# Altium schematic sheet Схема.SchDoc
size 594 x 840 mm
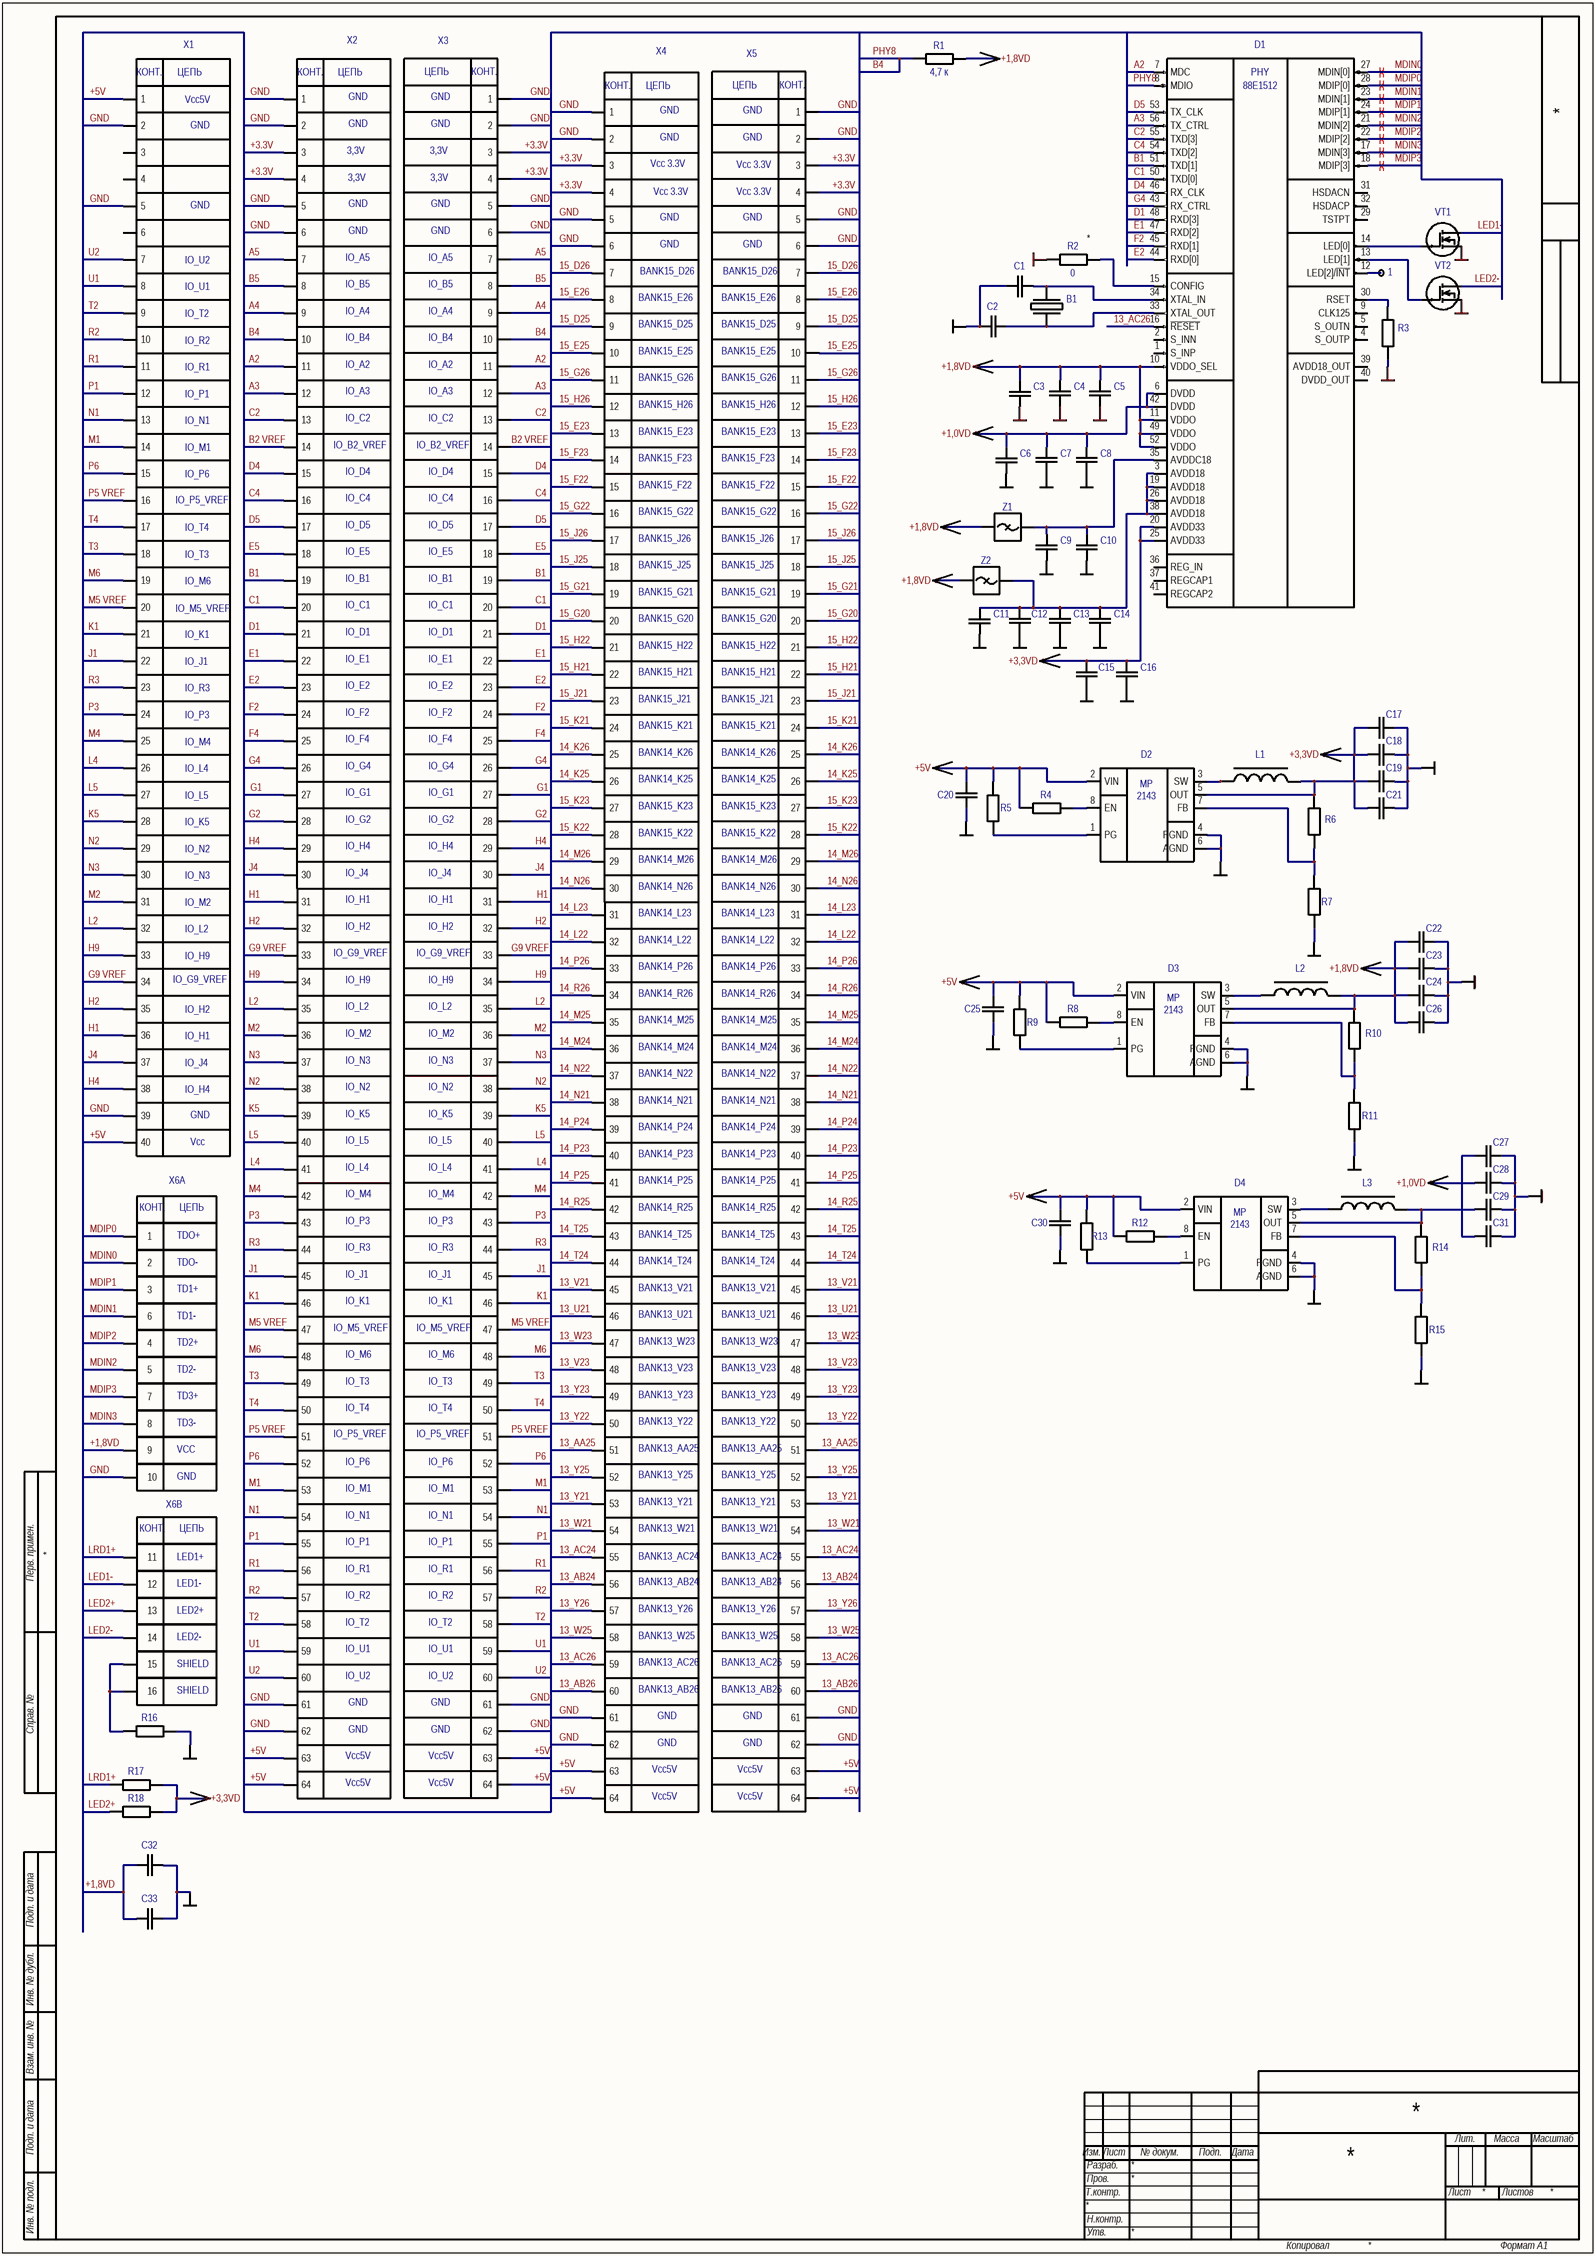
[diagram p0: Схема.SchDoc]

## Parts
(Parts that share a designator on the sheet are numbered #1, #2 ... from top to bottom, then left to right.)
1  TP_1  [TP0.3]  (value not drawn)  (no BOM)
*?#1  VCC  (value not drawn)  (graphical)
*?#2  VCC  (value not drawn)  (graphical)
*?#3  VCC  (value not drawn)  (graphical)
*?#4  VCC  (value not drawn)  (graphical)
*?#5  VCC  (value not drawn)  (graphical)
*?#6  VCC  (value not drawn)  (graphical)
*?#7  VCC  (value not drawn)  (graphical)
*?#8  VCC  (value not drawn)  (graphical)
*?#9  VCC  (value not drawn)  (graphical)
*?#10  VCC  (value not drawn)  (graphical)
*?#11  VCC  (value not drawn)  (graphical)
*?#12  VCC  (value not drawn)  (graphical)
*?#13  VCC  (value not drawn)  (graphical)
B1  РК540-5ДП-25000К-П18  [DFN580P700X120-4N]  (value not drawn)
C1  18  [CAPC1608L]  (value not drawn)
C2  18  [CAPC1608L]  (value not drawn)
C3  4,7 мк  [CAPC1608L]  (value not drawn)
C4  1 мк  [CAPC1608L]  (value not drawn)
C5  0,1 мк  [CAPC1005L]  (value not drawn)
C6  4,7 мк  [CAPC1608L]  (value not drawn)
C7  1 мк  [CAPC1608L]  (value not drawn)
C8  0,1 мк  [CAPC1005L]  (value not drawn)
C9  10 мк  [CAPC1608L]  (value not drawn)
C10  4,7 мк  [CAPC1608L]  (value not drawn)
C11  4,7 мк  [CAPC1608L]  (value not drawn)
C12  1 мк  [CAPC1608L]  (value not drawn)
C13  0,1 мк  [CAPC1005L]  (value not drawn)
C14  0,1 мк  [CAPC1005L]  (value not drawn)
C15  1 мк  [CAPC1608L]  (value not drawn)
C16  0,1 мк  [CAPC1005L]  (value not drawn)
C17  22 мк  [CAPC2012L]  (value not drawn)
C18  22 мк  [CAPC2012L]  (value not drawn)
C19  0,1 мк  [CAPC1608L]  (value not drawn)
C20  22 мк  [CAPC2012L]  (value not drawn)
C21  0,1 мк  [CAPC1608L]  (value not drawn)
C22  22 мк  [CAPC2012L]  (value not drawn)
C23  22 мк  [CAPC2012L]  (value not drawn)
C24  0,1 мк  [CAPC1608L]  (value not drawn)
C25  22 мк  [CAPC2012L]  (value not drawn)
C26  0,1 мк  [CAPC1608L]  (value not drawn)
C27  22 мк  [CAPC2012L]  (value not drawn)
C28  22 мк  [CAPC2012L]  (value not drawn)
C29  0,1 мк  [CAPC1608L]  (value not drawn)
C30  22 мк  [CAPC2012L]  (value not drawn)
C31  0,1 мк  [CAPC1608L]  (value not drawn)
C32  0,1 мк  [CAPC1608L]  (value not drawn)
C33  1000  [CAPC1608L]  (value not drawn)
D1  88E1512-A0-NNP2I000*  [QFN50P800X800X100_HS-57N]  (value not drawn)
D2  MP2143  [MP2143]  (value not drawn)
D3  MP2143  [MP2143]  (value not drawn)
D4  MP2143  [MP2143]  (value not drawn)
GND#1  GND GOST  (value not drawn)  (graphical)
GND#2  GND GOST  (value not drawn)  (graphical)
GND?#1  GND GOST  (value not drawn)  (graphical)
GND?#2  GND GOST  (value not drawn)  (graphical)
GND?#3  GND GOST  (value not drawn)  (graphical)
GND?#4  GND GOST  (value not drawn)  (graphical)
GND?#5  GND GOST  (value not drawn)  (graphical)
GND?#6  GND GOST  (value not drawn)  (graphical)
GND?#7  GND GOST  (value not drawn)  (graphical)
GND?#8  GND GOST  (value not drawn)  (graphical)
GND?#9  GND GOST  (value not drawn)  (graphical)
GND?#10  GND GOST  (value not drawn)  (graphical)
GND?#11  GND GOST  (value not drawn)  (graphical)
GND?#12  GND GOST  (value not drawn)  (graphical)
GND?#13  GND GOST  (value not drawn)  (graphical)
GND?#14  GND GOST  (value not drawn)  (graphical)
GND?#15  GND GOST  (value not drawn)  (graphical)
GND?#16  GND GOST  (value not drawn)  (graphical)
GND?#17  GND GOST  (value not drawn)  (graphical)
GND?#18  GND GOST  (value not drawn)  (graphical)
GND?#19  GND GOST  (value not drawn)  (graphical)
GND?#20  GND GOST  (value not drawn)  (graphical)
GND?#21  GND GOST  (value not drawn)  (graphical)
GND?#22  GND GOST  (value not drawn)  (graphical)
GND?#23  GND GOST  (value not drawn)  (graphical)
GND?#24  GND GOST  (value not drawn)  (graphical)
GND?#25  GND GOST  (value not drawn)  (graphical)
GND?#26  GND GOST  (value not drawn)  (graphical)
GND?#27  GND GOST  (value not drawn)  (graphical)
GND?#28  GND GOST  (value not drawn)  (graphical)
GND?#29  GND GOST  (value not drawn)  (graphical)
GND?#30  GND GOST  (value not drawn)  (graphical)
GND?#31  GND GOST  (value not drawn)  (graphical)
L1  1 мк  [INDC6466X32N]  (value not drawn)
L2  1 мк  [INDC6466X32N]  (value not drawn)
L3  1 мк  [INDC6466X32N]  (value not drawn)
R1  4,7 к  [RESC1005L]
R2  0  [RESC1005L]
R3  4,99 к  [RESC1608L]  (value not drawn)
R4  100 к  [RESC1608L]  (value not drawn)
R5  100 к  [RESC1608L]  (value not drawn)
R6  200 к  [RESC2012X90]  (value not drawn)
R7  44,2 к  [RESC1005L]  (value not drawn)
R8  100 к  [RESC1608L]  (value not drawn)
R9  100 к  [RESC1608L]  (value not drawn)
R10  200 к  [RESC2012X90]  (value not drawn)
R11  100 к  [RESC1608L]  (value not drawn)
R12  100 к  [RESC1608L]  (value not drawn)
R13  100 к  [RESC1608L]  (value not drawn)
R14  200 к  [RESC2012X90]  (value not drawn)
R15  300 к  [RESC1005L]  (value not drawn)
R16  0  [RESC1608L]  (value not drawn)
R17  750  [RESC1608L]  (value not drawn)
R18  750  [RESC1608L]  (value not drawn)
VT1  NDS331N  [SOT95P251X112-3N]  (value not drawn)
VT2  NDS331N  [SOT95P251X112-3N]  (value not drawn)
X1  PLD40  [PLD-40]  (value not drawn)
X2  PLD64  [PLD-64chin]  (value not drawn)
X3  pbd-64  [PBD-64chain]  (value not drawn)
X4  PLD64  [PLD-64chin]  (value not drawn)
X5  pbd-64  [PBD-64chain]  (value not drawn)
X6  HFJ11-1G01E-L12RL  [HALO_HFJ11-1G01E]  (value not drawn)  (parts A,B of 2)
Z1  BLM18PG471SN1  [INDC1608L]  (value not drawn)
Z2  BLM18PG471SN1  [INDC1608L]  (value not drawn)

## Nets
+1,0VD: C6.2 C7.1 C8.1 C28.1 D1.6(DVDD) D1.42(DVDD)
+1,8VD: C3.2 C4.1 C5.1 C22.1 C23.1 C24.1 C26.1 C32.1 C33.1 D1.10(VDDO_SEL) D1.11(VDDO) D1.49(VDDO) D1.52(VDDO) D3.5(OUT) L2.2 R1.1 R10.2 X6.9 Z1.1 Z2.1
+3,3VD: C15.1 C16.1 C17.1 C18.1 C19.1 C21.1 D1.20(AVDD33) D1.25(AVDD33) D2.5(OUT) L1.2 R6.2 R17.2 R18.2
+5V: C20.2 C25.2 C30.2 D2.2(VIN) D3.2(VIN) D4.2(VIN) R4.2 R5.2 R8.2 R9.2 R12.2 R13.2 X1.1 X1.40 X2.63 X2.64 X3.63 X3.64 X4.63 X4.64 X5.63 X5.64
GND: C1.1 C2.1 C3.1 C4.2 C5.2 C6.1 C7.2 C8.2 C9.1 C10.1 C11.1 C12.2 C13.2 C14.2 C15.2 C16.2 C17.2 C18.2 C19.2 C20.1 C21.2 C22.2 C23.2 C24.2 C25.1 C26.2 C27.2 C28.2 C29.2 C30.1 C31.2 C32.2 C33.2 D1.EPAD(VSS) D2.4(PGND) D2.6(AGND) D3.4(PGND) D3.6(AGND) D4.4(PGND) D4.6(AGND) R2.1 R3.2 R7.1 R11.1 R15.1 R16.2 VT1.2(source) VT2.2(source) X1.2 X1.5 X1.39 X2.1 X2.2 X2.5 X2.6 X2.61 X2.62 X3.1 X3.2 X3.5 X3.6 X3.61 X3.62 X4.1 X4.2 X4.5 X4.6 X4.61 X4.62 X5.1 X5.2 X5.5 X5.6 X5.61 X5.62 X6.10
13_AA25: X4.51 X5.51
13_AB24: X4.56 X5.56
13_AB26: X4.60 X5.60
13_AC24: X4.55 X5.55
13_AC26: D1.16(~{RESET}) X4.59 X5.59
13_U21: X4.46 X5.46
13_V21: X4.45 X5.45
13_V23: X4.48 X5.48
13_W21: X4.54 X5.54
13_W23: X4.47 X5.47
13_W25: X4.58 X5.58
13_Y21: X4.53 X5.53
13_Y22: X4.50 X5.50
13_Y23: X4.49 X5.49
13_Y25: X4.52 X5.52
13_Y26: X4.57 X5.57
14_K25: X4.26 X5.26
14_K26: X4.25 X5.25
14_L22: X4.32 X5.32
14_L23: X4.31 X5.31
14_M24: X4.36 X5.36
14_M25: X4.35 X5.35
14_M26: X4.29 X5.29
14_N21: X4.38 X5.38
14_N22: X4.37 X5.37
14_N26: X4.30 X5.30
14_P23: X4.40 X5.40
14_P24: X4.39 X5.39
14_P25: X4.41 X5.41
14_P26: X4.33 X5.33
14_R25: X4.42 X5.42
14_R26: X4.34 X5.34
14_T24: X4.44 X5.44
14_T25: X4.43 X5.43
15_D25: X4.9 X5.9
15_D26: X4.7 X5.7
15_E23: X4.13 X5.13
15_E25: X4.10 X5.10
15_E26: X4.8 X5.8
15_F22: X4.15 X5.15
15_F23: X4.14 X5.14
15_G20: X4.20 X5.20
15_G21: X4.19 X5.19
15_G22: X4.16 X5.16
15_G26: X4.11 X5.11
15_H21: X4.22 X5.22
15_H22: X4.21 X5.21
15_H26: X4.12 X5.12
15_J21: X4.23 X5.23
15_J25: X4.18 X5.18
15_J26: X4.17 X5.17
15_K21: X4.24 X5.24
15_K22: X4.28 X5.28
15_K23: X4.27 X5.27
+3.3V: X2.3 X2.4 X3.3 X3.4 X4.3 X4.4 X5.3 X5.4
A2: D1.7(MDC) X2.11 X3.11
A3: D1.56(TX_CTRL) X2.12 X3.12
A4: X2.9 X3.9
A5: X2.7 X3.7
B1: D1.51(TXD[1]) X2.19 X3.19
B2 VREF: X2.14 X3.14
B4: D1.8(MDIO) R1.2 X2.10 X3.10  [also labelled PHY8]
B5: X2.8 X3.8
C1: D1.50(TXD[0]) X2.20 X3.20
C2: D1.55(TXD[3]) X2.13 X3.13
C4: D1.54(TXD[2]) X2.16 X3.16
D1: D1.48(RXD[3]) X2.21 X3.21
D4: D1.46(RX_CLK) X2.15 X3.15
D5: D1.53(TX_CLK) X2.17 X3.17
E1: D1.47(RXD[2]) X2.22 X3.22
E2: D1.44(RXD[0]) X2.23 X3.23
E5: X2.18 X3.18
F2: D1.45(RXD[1]) X2.24 X3.24
F4: X2.25 X3.25
G1: X2.27 X3.27
G2: X2.28 X3.28
G4: D1.43(RX_CTRL) X2.26 X3.26
G9 VREF: X1.34 X2.33 X3.33
H1: X1.36 X2.31 X3.31
H2: X1.35 X2.32 X3.32
H4: X1.38 X2.29 X3.29
H9: X1.33 X2.34 X3.34
J1: X1.22 X2.45 X3.45
J4: X1.37 X2.30 X3.30
K1: X1.21 X2.46 X3.46
K5: X1.28 X2.39 X3.39
L2: X1.32 X2.35 X3.35
L4: X1.26 X2.41 X3.41
L5: X1.27 X2.40 X3.40
LED1-: VT1.3(drain) X6.12
LED2+: R18.1 X6.13
LED2-: VT2.3(drain) X6.14
LRD1+: R17.1 X6.11
M1: X1.14 X2.53 X3.53
M2: X1.31 X2.36 X3.36
M4: X1.25 X2.42 X3.42
M5 VREF: X1.20 X2.47 X3.47
M6: X1.19 X2.48 X3.48
MDIN0: D1.27(MDIN[0]) X6.2
MDIN1: D1.23(MDIN[1]) X6.6
MDIN2: D1.21(MDIN[2]) X6.5
MDIN3: D1.17(MDIN[3]) X6.8
MDIP0: D1.28(MDIP[0]) X6.1
MDIP1: D1.24(MDIP[1]) X6.3
MDIP2: D1.22(MDIP[2]) X6.4
MDIP3: D1.18(MDIP[3]) X6.7
N1: X1.13 X2.54 X3.54
N2: X1.29 X2.38 X3.38
N3: X1.30 X2.37 X3.37
P1: X1.12 X2.55 X3.55
P3: X1.24 X2.43 X3.43
P5 VREF: X1.16 X2.51 X3.51
P6: X1.15 X2.52 X3.52
R1: X1.11 X2.56 X3.56
R2: X1.10 X2.57 X3.57
R3: X1.23 X2.44 X3.44
T2: X1.9 X2.58 X3.58
T3: X1.18 X2.49 X3.49
T4: X1.17 X2.50 X3.50
U1: X1.8 X2.59 X3.59
U2: X1.7 X2.60 X3.60
Net1_1: 1.1 D1.12(LED[2]/~{INT})
NetB1_1: B1.1 C2.2 D1.33(XTAL_OUT)
NetB1_3: B1.3 C1.2 D1.34(XTAL_IN)
NetC9_2: C9.2 C10.2 D1.35(AVDDC18) Z1.2
NetC11_2: C11.2 C12.1 C13.1 C14.1 D1.3(AVDD18) D1.19(AVDD18) D1.26(AVDD18) D1.38(AVDD18) Z2.2
NetC27_1: C27.1 C31.1
NetC29_1: C29.1 D4.5(OUT) L3.2 R14.2
NetD1_13: D1.13(LED[1]) VT2.1(gate)
NetD1_14: D1.14(LED[0]) VT1.1(gate)
NetD1_15: D1.15(CONFIG) R2.2
NetD1_30: D1.30(RSET) R3.1
NetD2_1: D2.1(PG) R5.1
NetD2_3: D2.3(SW) L1.1
NetD2_7: D2.7(FB) R6.1 R7.2
NetD2_8: D2.8(EN) R4.1
NetD3_1: D3.1(PG) R9.1
NetD3_3: D3.3(SW) L2.1
NetD3_7: D3.7(FB) R10.1 R11.2
NetD3_8: D3.8(EN) R8.1
NetD4_1: D4.1(PG) R13.1
NetD4_3: D4.3(SW) L3.1
NetD4_7: D4.7(FB) R14.1 R15.2
NetD4_8: D4.8(EN) R12.1
NetR16_1: R16.1 X6.15 X6.16

Not connected (* = marked no-connect by the designer): B1 2 4; D1 1(S_INP) 2(S_INN) 4(S_OUTP) 5(S_OUTN) 9(CLK125) 29(TSTPT) 31(HSDACN) 32(HSDACP) 36(REG_IN) 37(REGCAP1) 39(AVDD18_OUT) 40(DVDD_OUT) 41(REGCAP2); X1 3 4 6

## Layout directives
differential pair: MDIN0, MDIN1, MDIN2, MDIN3, MDIP0, MDIP1, MDIP2, MDIP3

## Notes on the sheet
- Vcc5V
- GND
- 3,3V
- Vcc 3.3V
- (near X5) Vcc 3.3V
- IO_A5
- (near R2) *
- IO_U2
- IO_U1
- IO_B5
- BANK15_D26
- IO_T2
- IO_A4
- BANK15_E26
- BANK15_D25
- IO_R2
- IO_B4
- BANK15_E25
- IO_R1
- IO_A2
- IO_A3
- BANK15_G26
- IO_P1
- IO_N1
- IO_C2
- BANK15_H26
- IO_M1
- IO_B2_VREF
- (near X3) IO_B2_VREF
- BANK15_E23
- BANK15_F23
- IO_P6
- IO_D4
- BANK15_F22
- IO_P5_VREF
- IO_T4
- IO_C4
- IO_D5
- BANK15_G22
- IO_T3
- IO_E5
- BANK15_J26
- IO_M6
- IO_B1
- BANK15_J25
- BANK15_G21
- IO_M5_VREF
- IO_C1
- BANK15_G20
- IO_K1
- IO_J1
- IO_D1
- IO_E1
- BANK15_H22
- IO_R3
- IO_E2
- BANK15_H21
- BANK15_J21
- IO_P3
- IO_F2
- BANK15_K21
- IO_M4
- IO_F4
- IO_G4
- BANK14_K26
- IO_L4
- IO_L5
- IO_G1
- BANK14_K25
- IO_K5
- IO_G2
- BANK15_K23
- BANK15_K22
- IO_N2
- IO_H4
- BANK14_M26
- IO_N3
- IO_M2
- IO_J4
- IO_H1
- BANK14_N26
- IO_L2
- IO_H2
- BANK14_L23
- IO_H9
- IO_G9_VREF
- (near X3) IO_G9_VREF
- BANK14_L22
- BANK14_P26
- BANK14_R26
- BANK14_M25
- BANK14_M24
- BANK14_N22
- BANK14_N21
- BANK14_P24
- Vcc
- BANK14_P23
- BANK14_P25
- BANK14_R25
- BANK14_T25
- BANK14_T24
- BANK13_V21
- (near X3) IO_M5_VREF
- BANK13_U21
- BANK13_W23
- BANK13_V23
- BANK13_Y23
- (near X3) IO_P5_VREF
- BANK13_Y22
- BANK13_AA25
- BANK13_Y25
- (near X5) BANK13_AA25
- BANK13_Y21
- BANK13_W21
- BANK13_AC24
- BANK13_AB24
- (near X5) BANK13_AC24
- (near X5) BANK13_AB24
- BANK13_Y26
- BANK13_W25
- BANK13_AC26
- (near X5) BANK13_AC26
- BANK13_AB26
- (near X5) BANK13_AB26
- Перв. примен.
- Справ. №
- Подп. и дата
- Инв. № дубл.
- Взам. инв. №
- Изм.
- Лист
- № докум.
- Подп.
- Дата
- Лит.
- Масса
- Масштаб
- Т.контр.
- Пров.
- Разраб.
- Листов
- Инв. № подл.
- Н.контр.
- Утв.
- Копировал
- Формат А1
- (in symbol 88E1512-A0-NNP2I000) PHY; 88E1512
- (in symbol HFJ11-1G01E-L12RL, part A) КОНТ.; ЦЕПЬ; TDO+; TDO-; TD1+; TD1-; TD2+; TD2-; TD3+; TD3-; VCC; GND
- (in symbol HFJ11-1G01E-L12RL, part B) КОНТ.; ЦЕПЬ; LED1+; LED1-; LED2+; LED2-; SHIELD
- (in symbol MP2143) MP; 2143
- (in symbol pbd-64) ЦЕПЬ; КОНТ.
- (in symbol PLD40) КОНТ.; ЦЕПЬ
- (in symbol PLD64) КОНТ.; ЦЕПЬ

## Library data of the parts
1 = TP_1: Test point
*?#1-*?#13 = VCC: Порт ЕСКД. Для "наложения" на штатный Power Bar
B1 = РК540-5ДП-25000К-П18: SMD кварцевый резонатор; Manufacturer: Завод «Метеор»; SymAuthor: Ерешко П.А.; TU/GOST: КЖДГ.433513.018ТУ; ManufacturerPartNumber: РК540-5ДП-25000К-П18; Package: 5,0×3,2×1,05 мм; Type: Резонатор кварцевый
C1 C2 = i6124B5A087073000028: Чип-конденсатор; ManufacturerPartNumber: ATC600S180GT250*T (0603 NP0 18 пФ ±2 % 250 В); Name: 0603; Power/Voltage: 250 В; TKE/TKC: {TKE/TKC}; Tolerance: ±2 %; PCADSymbol: C; PCADLibrary: PASSIV.LIB; BCPId: *; Manufacturer: *; Type: Конденсатор; Value: 18; ImKey: i6124B5A087073000028; PCADType: C0603; PCADPattern: C0603
C3 C6 C10 C11 = i6124B5A08768E000004: Чип-конденсатор; ManufacturerPartNumber: GRM188R61E475KE11* Murata; Name: 0603; Power/Voltage: 25 В; TKE/TKC: X5R; Tolerance: ±10 %; PCADSymbol: C; PCADLibrary: PASSIV.LIB; BCPId: *; Manufacturer: *; Type: Конденсатор; Value: 4,7 мк; ImKey: i6124B5A08768E000004; PCADType: C0603; PCADPattern: C0603
C4 C7 C12 C15 = i6124B5A08768700000A: Чип-конденсатор; ManufacturerPartNumber: GCM188R71E105KA64* Murata; Name: 0603; Power/Voltage: 25 В; TKE/TKC: X7R; Tolerance: ±10 %; PCADSymbol: C; PCADLibrary: PASSIV.LIB; BCPId: *; Manufacturer: *; Type: Конденсатор; Value: 1 мк; ImKey: i6124B5A08768700000A; PCADType: C0603; PCADPattern: C0603
C5 C8 C13 C14 C16 = i6124B5A087684000003: Чип-конденсатор; ManufacturerPartNumber: GRM155R71H104KE14* Murata; Name: 0402; Power/Voltage: 50 В; TKE/TKC: X7R; Tolerance: ±10 %; PCADSymbol: C; PCADLibrary: PASSIV.LIB; BCPId: *; Manufacturer: *; Type: Конденсатор; Value: 0,1 мк; ImKey: i6124B5A087684000003; PCADType: C0402; PCADPattern: C0402
C9 = i6124B5A08768E000003: Чип-конденсатор; ManufacturerPartNumber: GRM188R61E106MA73* Murata; Name: 0603; Power/Voltage: 25 В; TKE/TKC: X5R; Tolerance: ±20 %; PCADSymbol: C; PCADLibrary: PASSIV.LIB; BCPId: *; Manufacturer: *; Type: Конденсатор; Value: 10 мк; ImKey: i6124B5A08768E000003; PCADType: C0603; PCADPattern: C0603
C17 C18 C20 C22 C23 C25 C27 C28 C30 = i6124B5A08704300000C: Чип-конденсатор; ManufacturerPartNumber: 0805 X5R 22 мкФ ±10 % 16 В; Name: 0805; Power/Voltage: 16 В; TKE/TKC: {TKE/TKC}; Tolerance: ±10 %; PCADSymbol: C; PCADLibrary: PASSIV.LIB; BCPId: *; Manufacturer: *; Type: Конденсатор; Value: 22 мк; ImKey: i6124B5A08704300000C; PCADType: C0805; PCADPattern: C0805
C19 C21 C24 C26 C29 C31 C32 = i6124B5A08701E000001: Чип-конденсатор; ManufacturerPartNumber: 0603 X7R 0,1 мкФ ±10 % 50 В; Name: 0603; Power/Voltage: 50 В; TKE/TKC: {TKE/TKC}; Tolerance: ±10 %; PCADSymbol: C; PCADLibrary: PASSIV.LIB; BCPId: *; Manufacturer: *; Type: Конденсатор; Value: 0,1 мк; ImKey: i6124B5A08701E000001; PCADType: C0603; PCADPattern: C0603
C33 = i6124B5A08701E000003: Чип-конденсатор; ManufacturerPartNumber: 0603 X7R 1000 пФ ±10 % 50 В; Name: 0603; Power/Voltage: 50 В; TKE/TKC: {TKE/TKC}; Tolerance: ±10 %; PCADSymbol: C; PCADLibrary: PASSIV.LIB; BCPId: *; Manufacturer: *; Type: Конденсатор; Value: 1000; ImKey: i6124B5A08701E000003; PCADType: C0603; PCADPattern: C0603
D1 = 88E1512-A0-NNP2I000: Gigabit Ethernet Transceiver; Manufacturer: Marvell; Type: Микросхема; SymAuthor: Семенов В.С.; BCPId: *; ManufacturerPartNumber: 88E1512-A0-NNP2I000*; HelpURL: *; Package: 56-Pin QFN; Price: *; Rem: *; Vendor: *
D2-D4 = MP2143: Type: Микросхема; BCPId: *; Name: *; ManufacturerPartNumber: MP2143
GND#1 GND#2 GND?#1-GND?#31 = GND GOST: Корпус ЕСКД. Для "наложения" на штатный GOST Power Bar
L1-L3 = i6124B5A0877B8000001: Дроссель; Manufacturer: Coilcraft; ManufacturerPartNumber: XEL6030-102ME* Coilcraft; Tolerance: ±20 %; SymAuthor: Семенов В.С.; PCADType: XEL6030; PCADSymbol: INDUCT; PCADLibrary: PASSIV.LIB; BCPId: *; Name: *; Package: XEL6030-471MEB; Type: Дроссель; Value: 1 мк; ImKey: i6124B5A0877B8000001
R1 = i6124B5A0870A6000005: Чип-резистор; ManufacturerPartNumber: Р1-12-0,062-4,7 кОм ±5 % - Т; Name: 0402; Tolerance: ±5 %; Power/Voltage: 0,062 Вт; TU/GOST: АЛЯР.434110.005 ТУ; BCPId: *; Manufacturer: *; Type: Резистор; Value: 4,7 к; ImKey: i6124B5A0870A6000005
R2 = i6124B5A0870A6000019: Чип-резистор; ManufacturerPartNumber: Р1-8В-0402-0; Name: 0402; Tolerance: {Tolerance}; Power/Voltage: 0,062 Вт; TU/GOST: ОЖ0.467.164 ТУ; TKE/TKC: ±200  X10-6/ °С; BCPId: *; Manufacturer: *; Type: Резистор; Value: 0; ImKey: i6124B5A0870A6000019
R3 = i6124B5A08741A000016: Чип-резистор; ManufacturerPartNumber: Р1-12-0,1-4,99 кОм ±1 % - Т; Name: 0603; Tolerance: ±1 %; Power/Voltage: 0,1 Вт; TU/GOST: АЛЯР.434110.005 ТУ; BCPId: *; Manufacturer: *; Type: Резистор; Value: 4,99 к; ImKey: i6124B5A08741A000016
R4 R5 R8 R9 R11-R13 = i6124B5A08707A000017: Чип-резистор; ManufacturerPartNumber: Р1-12-0,1-100 кОм ±5 % - Т; Name: 0603; Tolerance: ±5 %; Power/Voltage: 0,1 Вт; TU/GOST: АЛЯР.434110.005 ТУ; BCPId: *; Manufacturer: *; Type: Резистор; Value: 100 к; ImKey: i6124B5A08707A000017
R6 R10 R14 = i6124B5A08A76800003C: Резистор; ManufacturerPartNumber: Р1-16П-0,062 Вт-200 кОм ±0,5%-0,5-Ж; TU: АЛЯР.434110.002ТУ; Tolerance: ±0,5 %; Power/Voltage: 0,062 Вт; TU/GOST: АЛЯР.434110.002 ТУ; Type: Резистор; Name: Р1-16П-0,062; Value: 200 к; HelpURL: *; BCPId: *; ImKey: i6124B5A08A76800003C
R7 = i6124B5A08765B00000D: Чип-резистор; ManufacturerPartNumber: Р1-12-0,062-44,2 кОм ±1 % - Т; Name: 0402; Tolerance: ±1 %; Power/Voltage: 0,062 Вт; TU/GOST: АЛЯР.434110.005 ТУ; BCPId: *; Manufacturer: *; Type: Резистор; Value: 44,2 к; ImKey: i6124B5A08765B00000D
R15 = i6124B5A0870A6000055: Чип-резистор; ManufacturerPartNumber: Р1-12-0,062-300 кОм ±5 % - Т; Name: 0402; Tolerance: ±5 %; Power/Voltage: 0,062 Вт; TU/GOST: АЛЯР.434110.005 ТУ; BCPId: *; Manufacturer: *; Type: Резистор; Value: 300 к; ImKey: i6124B5A0870A6000055
R16 = i6124B5A08707A000077: Чип-резистор; ManufacturerPartNumber: Р1-8В-0603-0; Name: 0603; Tolerance: ±5 %; Power/Voltage: 0,1 Вт; TU/GOST: ОЖ0.467.164 ТУ; BCPId: *; Manufacturer: *; Type: Резистор; Value: 0; ImKey: i6124B5A08707A000077
R17 R18 = i6124B5A08707A00003B: Чип-резистор; ManufacturerPartNumber: Р1-12-0,1-750 Ом ±5 % - Т; Name: 0603; Tolerance: ±5 %; Power/Voltage: 0,1 Вт; TU/GOST: АЛЯР.434110.005 ТУ; BCPId: *; Manufacturer: *; Type: Резистор; Value: 750; ImKey: i6124B5A08707A00003B
VT1 VT2 = NDS331N: N-Channel Logic Level Field Effect Transistor; Manufacturer: Fairchild Semiconductor; Type: Транзистор; BCPId: *; ManufacturerPartNumber: NDS331N; Package: SOT-23
X1 = PLD40: Штыри на плату, шаг 2.54мм., двухрядные; BCPId: *; ManufacturerPartNumber: PLD40; Rem: *; Package: *; TU/GOST: *; Type: Вилка; HelpURL: *; Price: *
X2 X4 = PLD64: Штыри на плату, шаг 2.54мм., двухрядные; BCPId: *; ManufacturerPartNumber: PLD64; Rem: *; Package: *; TU/GOST: *; Type: Вилка; HelpURL: *; Price: *
X3 X5 = pbd-64: Гнездо на плату шаг 2.54мм., двухрядные; Manufacturer: Бурый Медведь; BCPId: *; ManufacturerPartNumber: pbd-64; Type: Розетка
X6 = HFJ11-1G01E-L12RL: Gigabit (10/100/1000) Ethernet RJ45 со светодиодами.; Manufacturer: HALO Electronics; BCPId: *; Type: Розетка; ManufacturerPartNumber: HFJ11-1G01E-L12RL; TU/GOST: *; Rem: *
Z1 Z2 = BLM18P: Помехоподавляющий фильтр; Manufacturer: Murata; BCPId: *; Package: 0603; Tolerance: *; ManufacturerPartNumber: BLM18PG471SN1; Type: Фильтр